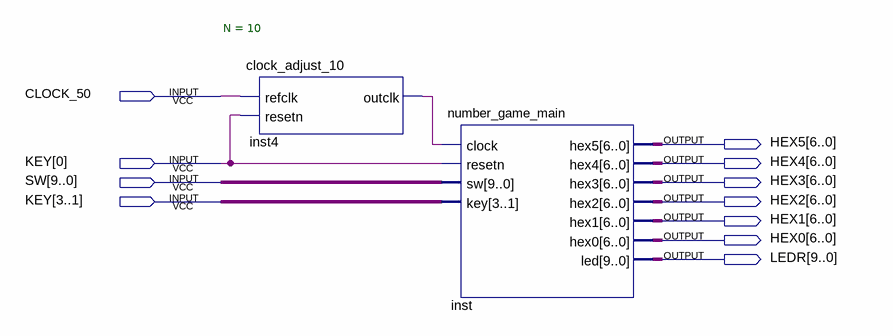
[diagram p0: schematic sheet]
// Quartus schematic number_game.bdf as structural Verilog: 2 symbols, 11 pins
module number_game (
  input  CLOCK_50,
  input  [3:0] KEY,
  input  [9:0] SW,
  output [6:0] HEX5,
  output [6:0] HEX4,
  output [6:0] HEX3,
  output [6:0] HEX2,
  output [6:0] HEX1,
  output [6:0] HEX0,
  output [9:0] LEDR
);

  wire inst4_outclk;

  clock_adjust_10 #(.N(10)) inst4 (.refclk(CLOCK_50), .resetn(KEY[0]), .outclk(inst4_outclk));
  number_game_main inst (
    .clock(inst4_outclk), .resetn(KEY[0]), .sw(SW), .key(KEY[3:1]), .hex5(HEX5), .hex4(HEX4), .hex3(HEX3),
    .hex2(HEX2), .hex1(HEX1), .hex0(HEX0), .led(LEDR));
endmodule
